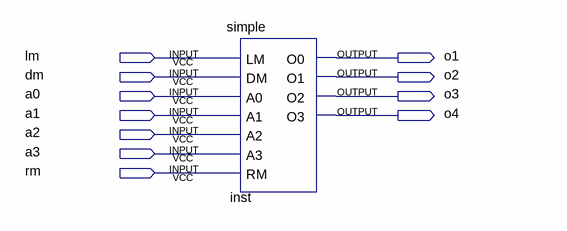
[diagram p0: schematic sheet]
// Quartus schematic exp4.bdf as structural Verilog: 1 symbols, 11 pins
module exp4 (
  input  lm,
  input  dm,
  input  a0,
  input  a1,
  input  a2,
  input  a3,
  input  rm,
  output o1,
  output o2,
  output o3,
  output o4
);

  simple inst (.LM(lm), .DM(dm), .A0(a0), .A1(a1), .A2(a2), .A3(a3), .RM(rm), .O0(o1), .O1(o2), .O2(o3), .O3(o4));
endmodule
